# Altium schematic sheet SC945D_Touchscreen.SchDoc: Touchscreen
size 393 x 270 mm; CompanyName: Seccom; Address1: 521, rue du capt. François Garbit; Address2: 69440 Mornant; Address3: seccom@seccom.fr; Address4: www.seccom.fr; DocumentNumber: 7; SheetNumber: 7; SheetTotal: 9; PageSetup: Record=PageOptions|CenterHorizontal=True|CenterVertical=True|PrintScale=0.74|XCorrection=1.00|YCorrection=1.00|PrintKind=0|BorderSize=5000000|LeftOffset=0|BottomOffset=0|Orientation=2|PaperLength=1000|PaperWidth=1000|Scale=100|PaperSource=7|PrintQuality=-4|MediaType=1|DitherType=10|PaperKind=A4|PrintScaleMode=1
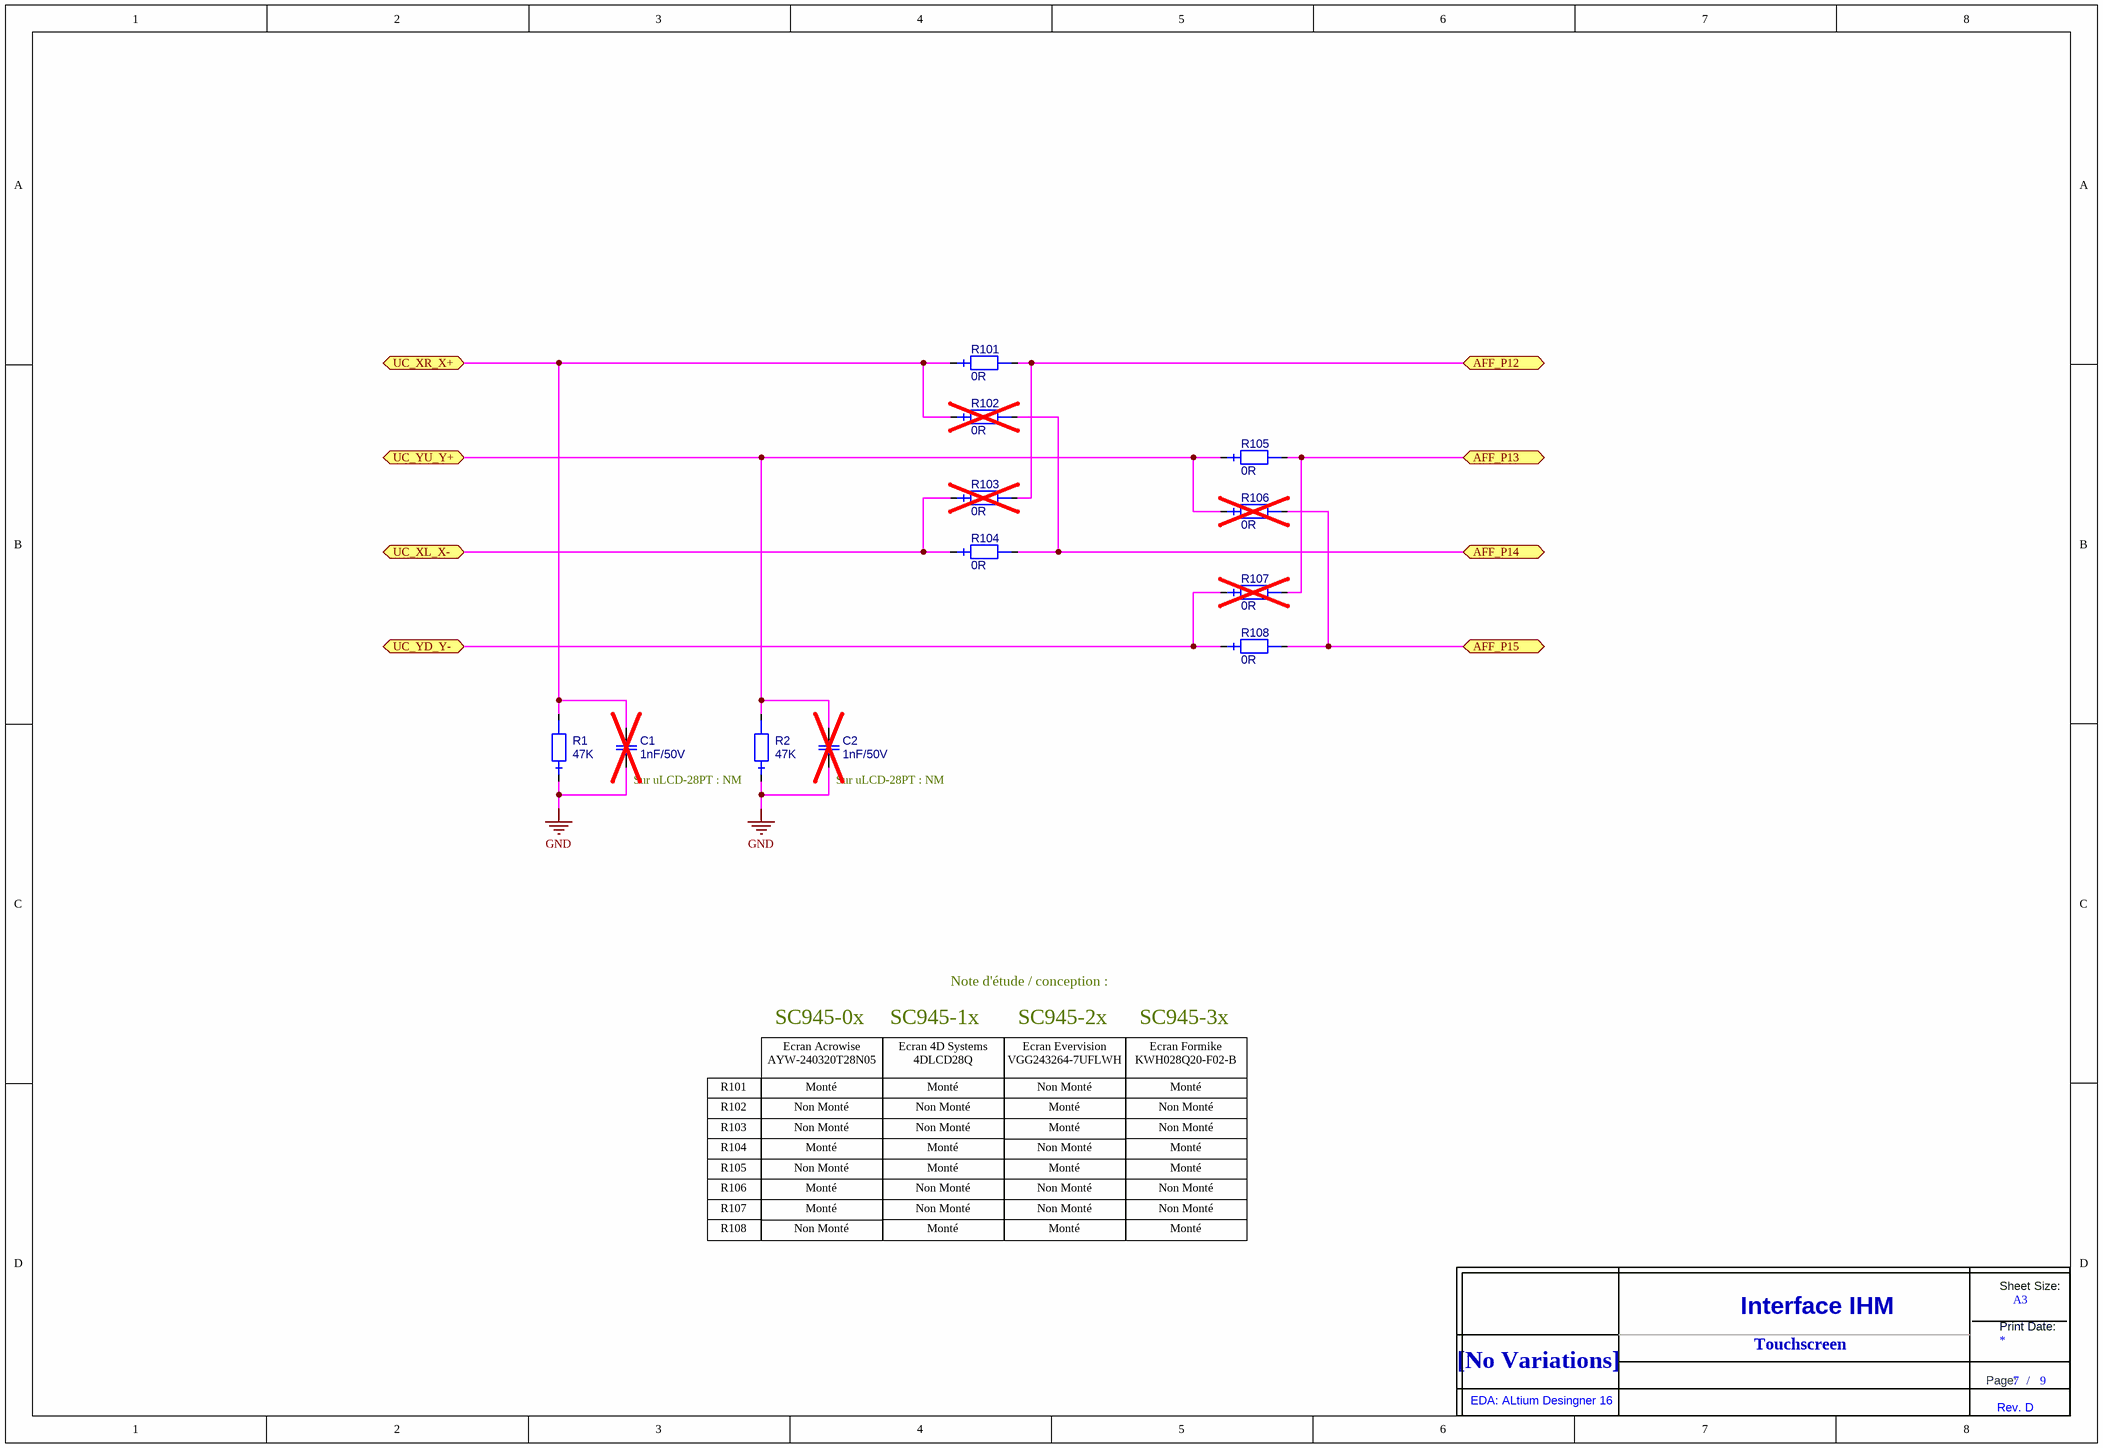
[diagram p0: SC945D_Touchscreen.SchDoc]

## Parts
C1  value 1nF/50V  [0603_ReflowSoldering_CAP]  (hidden comment: C_0603_NPO_5%_1N-50V)  (no BOM)
C2  value 1nF/50V  [0603_ReflowSoldering_CAP]  (hidden comment: C_0603_NPO_5%_1N-50V)  (no BOM)
R1  value 47K  [0603_ReflowSoldering_RES]  (hidden comment: RES_0603_1%_100PPM_47K)
R2  value 47K  [0603_ReflowSoldering_RES]  (hidden comment: RES_0603_1%_100PPM_47K)
R101  value 0R  [0603_ReflowSoldering_RES]  (hidden comment: RES_0603_1%_100PPM_0R)
R102  value 0R  [0603_ReflowSoldering_RES]  (hidden comment: RES_0603_1%_100PPM_0R)  (no BOM)
R103  value 0R  [0603_ReflowSoldering_RES]  (hidden comment: RES_0603_1%_100PPM_0R)  (no BOM)
R104  value 0R  [0603_ReflowSoldering_RES]  (hidden comment: RES_0603_1%_100PPM_0R)
R105  value 0R  [0603_ReflowSoldering_RES]  (hidden comment: RES_0603_1%_100PPM_0R)
R106  value 0R  [0603_ReflowSoldering_RES]  (hidden comment: RES_0603_1%_100PPM_0R)  (no BOM)
R107  value 0R  [0603_ReflowSoldering_RES]  (hidden comment: RES_0603_1%_100PPM_0R)  (no BOM)
R108  value 0R  [0603_ReflowSoldering_RES]  (hidden comment: RES_0603_1%_100PPM_0R)
Title_new?  DNI  (value not drawn)  (graphical)

## Ports
AFF_P12 (bidir), AFF_P13 (bidir), AFF_P14 (bidir), AFF_P15 (bidir), UC_XL_X- (bidir), UC_XR_X+ (bidir), UC_YD_Y- (bidir), UC_YU_Y+ (bidir)

## Nets
GND: C1.1 C2.1 R1.1 R2.1
AFF_P12: R101.2 R103.2 ; port AFF_P12
AFF_P13: R105.2 R107.2 ; port AFF_P13
AFF_P14: R102.2 R104.2 ; port AFF_P14
AFF_P15: R106.2 R108.2 ; port AFF_P15
UC_XL_X-: R103.1 R104.1 ; port UC_XL_X-
UC_XR_X+: C1.2 R1.2 R101.1 R102.1 ; port UC_XR_X+
UC_YD_Y-: R107.1 R108.1 ; port UC_YD_Y-
UC_YU_Y+: C2.2 R2.2 R105.1 R106.1 ; port UC_YU_Y+

## Notes on the sheet
- Sur uLCD-28PT : NM
- (near C2) Sur uLCD-28PT : NM
- Note d'étude / conception :
- SC945-0x
- SC945-1x
- SC945-2x
- SC945-3x
- R101
- R102
- Ecran Acrowise
  AYW-240320T28N05
- Monté
- Non Monté
- Ecran 4D Systems
  4DLCD28Q
- Ecran Evervision
  VGG243264-7UFLWH
- Ecran Formike
  KWH028Q20-F02-B
- R103
- R104
- R105
- R106
- R107
- R108
- Touchscreen
- (in symbol Title_new) Sheet Size:; A3; Interface IHM; Print Date:; [No Variations]; Page:; /; EDA: ALtium Desingner 16; Rev. D

## Library data of the parts
C1 C2 = C_0603_NPO_5%_1N-50V: Condensateur céramique, NPO, 5%, CMS 0603; Creation: LJ; Reference: 001809/00; Boitier: 0603; Remarque: {Remarque}; Coeff: 1; Fabricant: AVX; Ref Fab: 06035A102JAT2A; ComponentLink1URL: o:\_Documentation\Datasheets\BC_Components\Condo_CMS_NPO-X7R-Y5V.pdf; ComponentLink2URL: o:\_Documentation\Datasheets\_BOITIERS\PASSIF_CMS\; Config: *; ComponentLink1Description: Datasheet; ComponentLink2Description: Datasheet Boitier; Supplier 1: Mouser; Supplier Part Number 1: 581-06035A102J
R1 R2 = RES_0603_1%_100PPM_47K: Résistance, 0.100W, 1%, 100ppm, 75V, 47K; Creation: JPL (05/07/12); Boitier: 0603; Remarque: {Remarque}; Fabricant: Vishay; Ref Fab: CRCW060347K0FKEA; Coeff: 1; Verification: *; ComponentLink1URL: O:\_Documentation\Datasheets\Vishay\Resistances_D-CRCWe3.pdf; ComponentLink2URL: o:\_Documentation\Datasheets\_BOITIERS\PASSIF_CMS\; Config: *; ComponentLink1Description: Datasheet; ComponentLink2Description: Datasheet Boitier; Supplier 1: Farnell; Supplier 2: RadioSpares; Supplier Part Number 1: 1469811; Supplier Part Number 2: 6790425
R101-R108 = RES_0603_1%_100PPM_0R: Résistance, 0.100W, 1%, 100ppm, 75V, 0R; Creation: FB (04/07/12); Boitier: 0603; Remarque: {Remarque}; Fabricant: Vishay; Ref Fab: CRCW06030000Z0EA; Coeff: 1; Verification: *; ComponentLink1URL: O:\_Documentation\Datasheets\Vishay\Resistances_D-CRCWe3.pdf; ComponentLink2URL: o:\_Documentation\Datasheets\_BOITIERS\PASSIF_CMS\; Config: *; ComponentLink1Description: Datasheet; ComponentLink2Description: Datasheet Boitier; Supplier 1: Farnell; Supplier Part Number 1: 1469739
Title_new? = Title_new